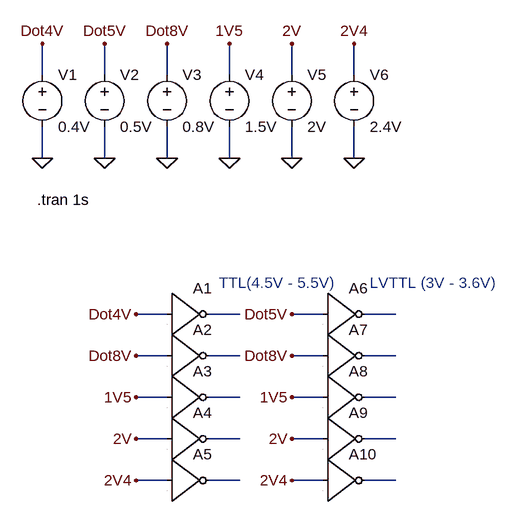
[diagram p0: schematic TTL_LVTTL_Tamplate.asc]
TTL_LVTTL_Tamplate.asc, the LTspice schematic file:
Version 4
SHEET 1 880 764
WIRE 112 80 112 32
WIRE 208 80 208 32
WIRE 304 80 304 32
WIRE 400 80 400 32
WIRE 496 80 496 32
WIRE 592 80 592 32
WIRE 112 208 112 160
WIRE 208 208 208 160
WIRE 304 208 304 160
WIRE 400 208 400 160
WIRE 496 208 496 160
WIRE 592 208 592 160
WIRE 304 448 256 448
WIRE 416 448 368 448
WIRE 544 448 496 448
WIRE 656 448 608 448
WIRE 304 512 256 512
WIRE 416 512 368 512
WIRE 544 512 496 512
WIRE 656 512 608 512
WIRE 304 576 256 576
WIRE 416 576 368 576
WIRE 544 576 496 576
WIRE 656 576 608 576
WIRE 304 640 256 640
WIRE 416 640 368 640
WIRE 544 640 496 640
WIRE 656 640 608 640
WIRE 304 704 256 704
WIRE 416 704 368 704
WIRE 544 704 496 704
WIRE 656 704 608 704
FLAG 112 208 0
FLAG 208 208 0
FLAG 304 208 0
FLAG 400 208 0
FLAG 496 208 0
FLAG 592 208 0
FLAG 112 32 Dot4V
FLAG 208 32 Dot5V
FLAG 304 32 Dot8V
FLAG 400 32 1V5
FLAG 496 32 2V
FLAG 592 32 2V4
FLAG 256 448 Dot4V
FLAG 496 448 Dot5V
FLAG 256 512 Dot8V
FLAG 256 576 1V5
FLAG 256 640 2V
FLAG 256 704 2V4
FLAG 496 576 1V5
FLAG 496 640 2V
FLAG 496 704 2V4
FLAG 496 512 Dot8V
SYMBOL voltage 112 64 R0
SYMATTR InstName V1
SYMATTR Value 0.4V
SYMBOL voltage 208 64 R0
SYMATTR InstName V2
SYMATTR Value 0.5V
SYMBOL voltage 304 64 R0
SYMATTR InstName V3
SYMATTR Value 0.8V
SYMBOL voltage 400 64 R0
SYMATTR InstName V4
SYMATTR Value 1.5V
SYMBOL voltage 496 64 R0
SYMATTR InstName V5
SYMATTR Value 2V
SYMBOL voltage 592 64 R0
SYMATTR InstName V6
SYMATTR Value 2.4V
SYMBOL Digital\\inv 304 384 R0
SYMATTR InstName A1
SYMBOL Digital\\inv 304 448 R0
SYMATTR InstName A2
SYMBOL Digital\\inv 304 512 R0
SYMATTR InstName A3
SYMBOL Digital\\inv 304 576 R0
SYMATTR InstName A4
SYMBOL Digital\\inv 304 640 R0
SYMATTR InstName A5
SYMBOL Digital\\inv 544 384 R0
SYMATTR InstName A6
SYMBOL Digital\\inv 544 448 R0
SYMATTR InstName A7
SYMBOL Digital\\inv 544 512 R0
SYMATTR InstName A8
SYMBOL Digital\\inv 544 576 R0
SYMATTR InstName A9
SYMBOL Digital\\inv 544 640 R0
SYMATTR InstName A10
TEXT 384 400 Left 2 ;TTL(4.5V - 5.5V)
TEXT 616 400 Left 2 ;LVTTL (3V - 3.6V)
TEXT 104 272 Left 2 !.tran 1s

The netlist it stands for:
* TTL_LVTTL_Tamplate.asc
V1 Dot4V 0 0.4V
V2 Dot5V 0 0.5V
V3 Dot8V 0 0.8V
V4 1V5 0 1.5V
V5 2V 0 2V
V6 2V4 0 2.4V
A1 Dot4V 0 0 0 0 N001 0 0 BUF
A2 Dot8V 0 0 0 0 N003 0 0 BUF
A3 1V5 0 0 0 0 N005 0 0 BUF
A4 2V 0 0 0 0 N007 0 0 BUF
A5 2V4 0 0 0 0 N009 0 0 BUF
A6 Dot5V 0 0 0 0 N002 0 0 BUF
A7 Dot8V 0 0 0 0 N004 0 0 BUF
A8 1V5 0 0 0 0 N006 0 0 BUF
A9 2V 0 0 0 0 N008 0 0 BUF
A10 2V4 0 0 0 0 N010 0 0 BUF
* TTL(4.5V - 5.5V)
* LVTTL (3V - 3.6V)
.tran 1s
.backanno
.end